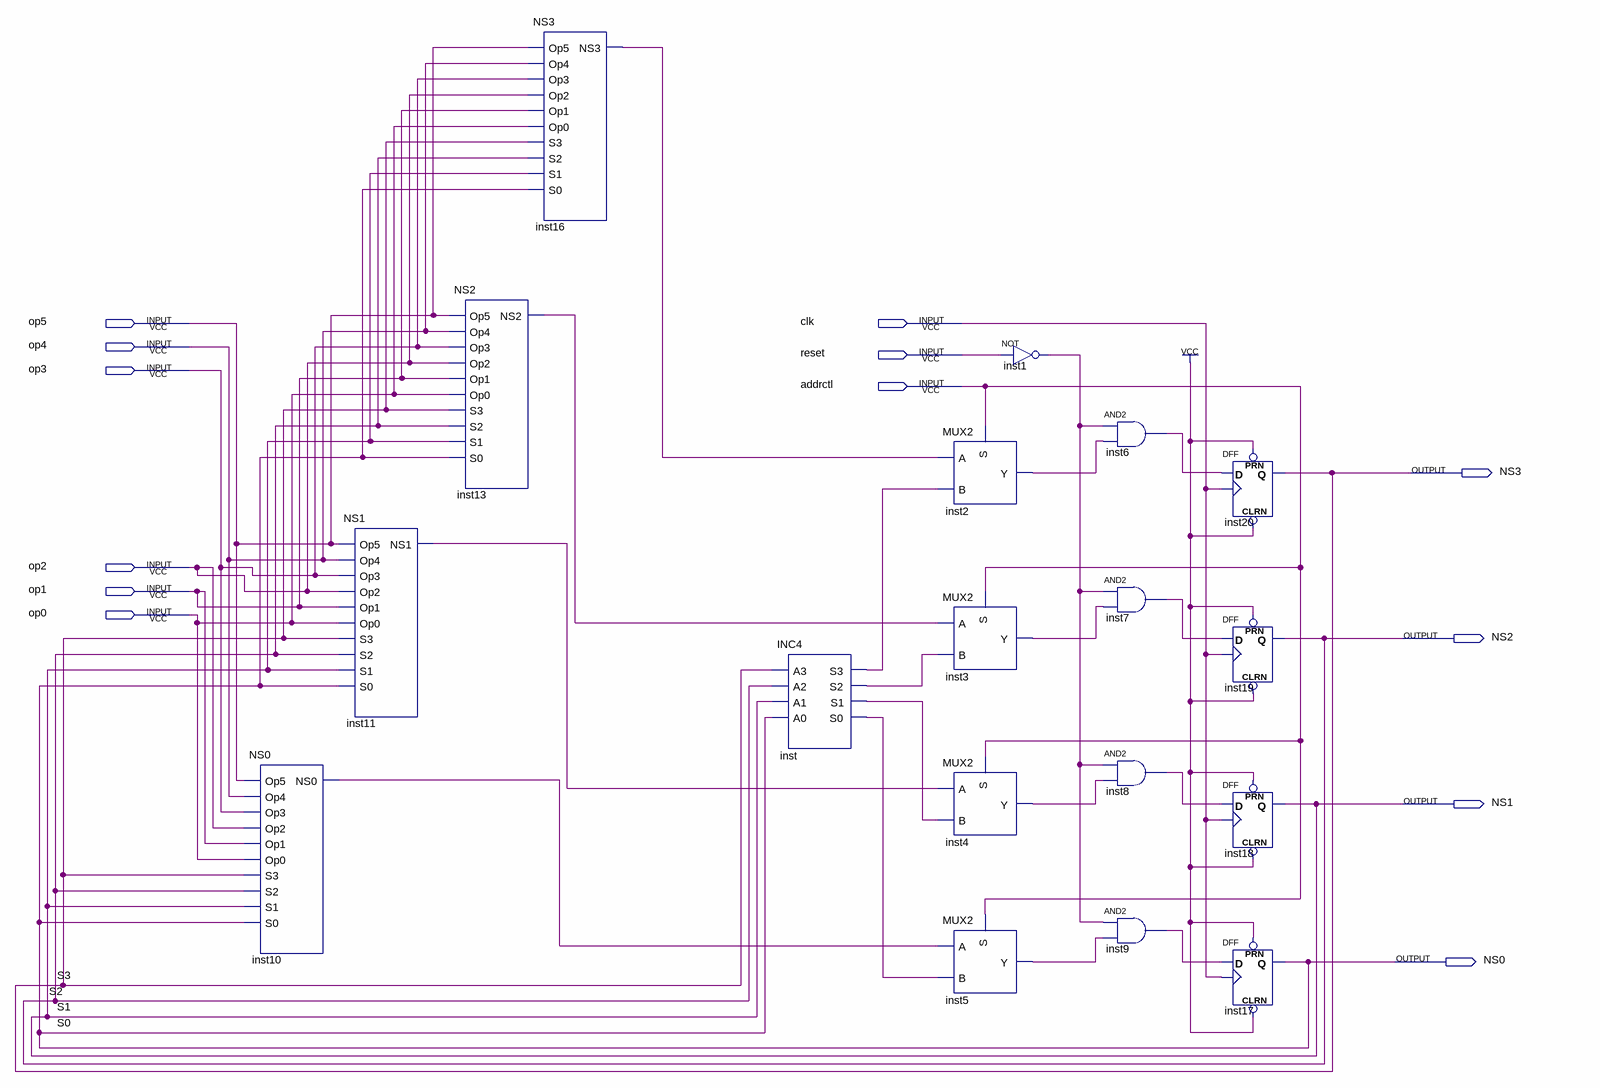
[diagram p0: schematic sheet]
// Quartus schematic FSM.bdf as structural Verilog: 18 symbols, 13 pins
module FSM (
  input  op5,
  input  clk,
  input  op4,
  input  reset,
  input  op3,
  input  addrctl,
  input  op2,
  input  op1,
  input  op0,
  output NS3,
  output NS2,
  output NS1,
  output NS0
);

  wire inst1_out, inst2_y, inst3_y, inst4_y, inst5_y, inst6_out, inst7_out, inst8_out, inst9_out, inst10_ns0,
       inst11_ns1, inst13_ns2, inst16_ns3, inst_s0, inst_s1, inst_s2, inst_s3;

  NS0 inst10 (
    .Op5(op5), .Op4(op4), .Op3(op3), .Op2(op2), .Op1(op1), .Op0(op0), .S3(NS3), .S2(NS2), .S1(NS1), .S0(NS0),
    .NS0(inst10_ns0));
  NS1 inst11 (
    .Op5(op5), .Op4(op4), .Op3(op3), .Op2(op2), .Op1(op1), .Op0(op0), .S3(NS3), .S2(NS2), .S1(NS1), .S0(NS0),
    .NS1(inst11_ns1));
  NS2 inst13 (
    .Op5(op5), .Op4(op4), .Op3(op3), .Op2(op2), .Op1(op1), .Op0(op0), .S3(NS3), .S2(NS2), .S1(NS1), .S0(NS0),
    .NS2(inst13_ns2));
  NS3 inst16 (
    .Op5(op5), .Op4(op4), .Op3(op3), .Op2(op2), .Op1(op1), .Op0(op0), .S3(NS3), .S2(NS2), .S1(NS1), .S0(NS0),
    .NS3(inst16_ns3));
  INC4 inst (.A3(NS3), .A2(NS2), .A1(NS1), .A0(NS0), .S3(inst_s3), .S2(inst_s2), .S1(inst_s1), .S0(inst_s0));
  MUX2 inst2 (.S(addrctl), .A(inst16_ns3), .B(inst_s3), .Y(inst2_y));
  MUX2 inst3 (.S(addrctl), .A(inst13_ns2), .B(inst_s2), .Y(inst3_y));
  MUX2 inst4 (.S(addrctl), .A(inst11_ns1), .B(inst_s1), .Y(inst4_y));
  MUX2 inst5 (.S(addrctl), .A(inst10_ns0), .B(inst_s0), .Y(inst5_y));
  not inst1 (inst1_out, reset);
  and inst6 (inst6_out, inst1_out, inst2_y);
  and inst7 (inst7_out, inst1_out, inst3_y);
  and inst8 (inst8_out, inst1_out, inst4_y);
  and inst9 (inst9_out, inst1_out, inst5_y);
  DFF inst20 (.CLRN(1'b1), .CLK(clk), .D(inst6_out), .PRN(1'b1), .Q(NS3));
  DFF inst19 (.CLRN(1'b1), .CLK(clk), .D(inst7_out), .PRN(1'b1), .Q(NS2));
  DFF inst18 (.CLRN(1'b1), .CLK(clk), .D(inst8_out), .PRN(1'b1), .Q(NS1));
  DFF inst17 (.CLRN(1'b1), .CLK(clk), .D(inst9_out), .PRN(1'b1), .Q(NS0));

  // Other names for the same wires on the sheet: S0 = NS0; S1 = NS1; S2 = NS2; S3 = NS3
endmodule
